# Altium project schematic.PrjPcb
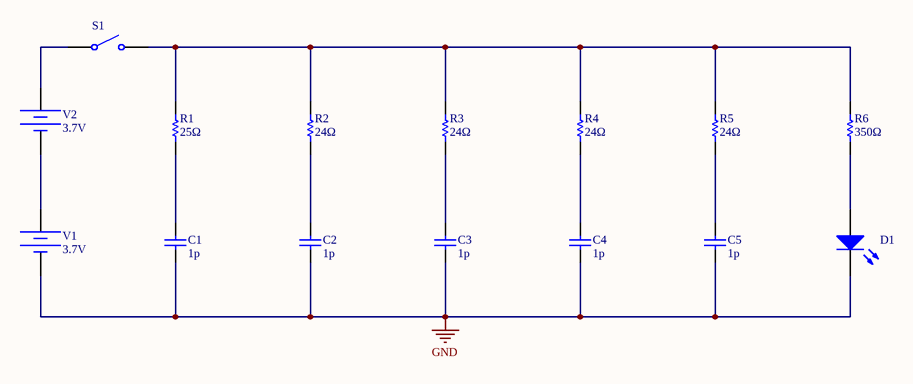
[diagram p0: power.SchDoc]
2 sheets, 18 parts. Net scope: flat (ports and power ports of the same name join across sheets).
Sheets:
  power.SchDoc
  microcontroller.SchDoc

## Sheet power.SchDoc
size A4; SheetNumber: 2; SheetTotal: 2

### Parts
(Parts that share a designator on the sheet are numbered #1, #2 ... from top to bottom, then left to right.)
C1#1  value 1p  (hidden comment: Capacitor)
C2  value 1p  (hidden comment: Capacitor)
C3  value 1p  (hidden comment: Capacitor)
C4  value 1p  (hidden comment: Capacitor)
C5  value 1p  (hidden comment: Capacitor)
D1  Light-Emitting Diode  (value not drawn)
R1#1  value 25Ω  (hidden comment: Resistor)
R2  value 24Ω  (hidden comment: Resistor)
R3  value 24Ω  (hidden comment: Resistor)
R4  value 24Ω  (hidden comment: Resistor)
R5  value 24Ω  (hidden comment: Resistor)
R6  value 350Ω  (hidden comment: Resistor)
S1  Single-Pole, Single-Throw Switch  (value not drawn)
V1  DC Magnitude: 3.7V  (hidden comment: Constant Voltage Source)
V2  DC Magnitude: 3.7V  (hidden comment: Constant Voltage Source)

### Nets
GND: C1#1.1 C2.1 C3.1 C4.1 C5.1 D1.2(K) V1.2
NetC1#1_2: C1#1.2 R1#1.1
NetC2_2: C2.2 R2.1
NetC3_2: C3.2 R3.1
NetC4_2: C4.2 R4.1
NetC5_2: C5.2 R5.1
NetD1_1: D1.1(A) R6.1
NetR1#1_2: R1#1.2 R2.2 R3.2 R4.2 R5.2 R6.2 S1.2
NetS1_1: S1.1 V2.1
NetV1_1: V1.1 V2.2

### Library data of the parts
C1#1 C2-C5 = Capacitor: SimulationGenericComponent: True
D1 = LED: AF: 1; BV: 0; BV_MAX: 1e99; EG: 1.11; FC: 0.5; IBV: 0.001; IS: 1e-14; MJSW: 0.33; NTUN: 30; TNOM: 27; XTI: 3; SimulationGenericComponent: True; CJO: 0; CJP: 0; CTA: 0; CTP: 0; FCS: 0.5; FV_MAX: 1e99; IKF: 0; IKR: 0; ISR: 1e-14; JSW: 0; JTUN: 0; JTUNSW: 0; KEG: 1; KF: 0; LEVEL: 1; N: 1; NBV: 1; NR: 1; NS: 1; PHP: 1; RS: 0; TCV: 0; TLEV: 0; TLEVC: 0; TM1: 0; TM2: 0; TPB: 0; TPHP: 0; TRS: 0; TRS2: 0; TT: 0; TTT1: 0; TTT2: 0; VJ: 1; XTITUN: 3
R1#1 R2-R6 = Resistor: TC1: 0; SimulationGenericComponent: True; TC2: 0
S1 = SPST SW: closed: 0; Rclosed: 1m; Ropen: 1Meg; SimulationGenericComponent: True
V1 V2 = Battery: SimulationGenericComponent: True

## Sheet microcontroller.SchDoc
size A4; SheetNumber: 2; SheetTotal: 2
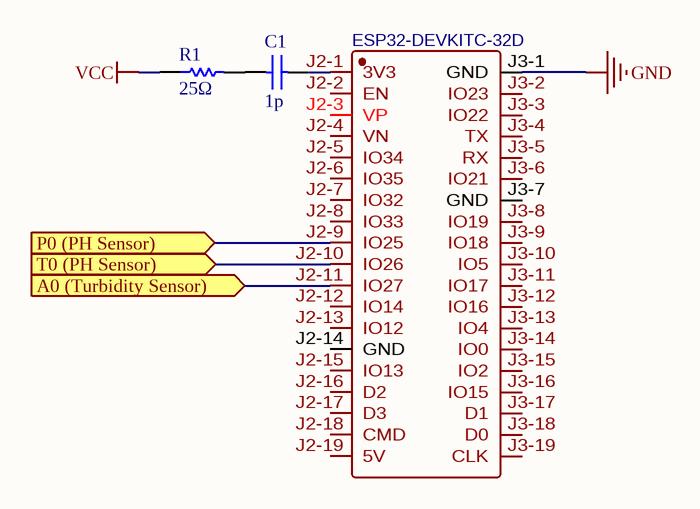
[diagram p1: microcontroller.SchDoc]

### Parts
(Parts that share a designator on the sheet are numbered #1, #2 ... from top to bottom, then left to right.)
C1#2  value 1p  (hidden comment: Capacitor)
R1#2  value 25Ω  (hidden comment: Resistor)
U1  ESP32-DEVKITC-32D  [COMM-SMD_ESP32-DEVKITC-32D]

### Ports
A0 (Turbidity Sensor) (in), P0 (PH Sensor) (in), T0 (PH Sensor) (in)

### Nets
GND: U1.J3-1(GND)
VCC: R1#2.1
NetC1#2_1: C1#2.1 R1#2.2
NetC1#2_2: C1#2.2 U1.J2-1(3V3)
NetU1_J2-9: U1.J2-9(IO25) ; port P0 (PH Sensor)
NetU1_J2-10: U1.J2-10(IO26) ; port T0 (PH Sensor)
NetU1_J2-11: U1.J2-11(IO27) ; port A0 (Turbidity Sensor)

Not connected (* = marked no-connect by the designer): U1 J2-2(EN) J2-3(VP) J2-4(VN) J2-5(IO34) J2-6(IO35) J2-7(IO32) J2-8(IO33) J2-12(IO14) J2-13(IO12) J2-14(GND) J2-15(IO13) J2-16(D2) J2-17(D3) J2-18(CMD) J2-19(5V) J3-2(IO23) J3-3(IO22) J3-4(TX) J3-5(RX) J3-6(IO21) J3-7(GND) J3-8(IO19) J3-9(IO18) J3-10(IO5) J3-11(IO17) J3-12(IO16) J3-13(IO4) J3-14(IO0) J3-15(IO2) J3-16(IO15) J3-17(D1) J3-18(D0) J3-19(CLK)

### Library data of the parts
C1#2 = Capacitor: SimulationGenericComponent: True
R1#2 = Resistor: TC1: 0; SimulationGenericComponent: True; TC2: 0
U1 = ESP32-DEVKITC-32D: Manufacturer: ESPRESSIF(乐鑫); Contributor: lcsc; Supplier: LCSC; Supplier Part: C571181; Manufacturer Part: ESP32-DevKitC-32D; JLCPCB Part Class: Extended Part; spicePre: U; spiceSymbolName: ESP32-DEVKITC-32D

## Nets that join several sheets
GND: power (7 pins), microcontroller (U1.J3-1)